# EasyEDA schematic SCH_PS2_Floppy_MediaSense_Adapter_2024-03-08.json
TITLE: PS/2 Floppy Media Sense; REV: 0.91a; Date: 2024-02-25; Sheet: 1/1; Company: Vincent Besson
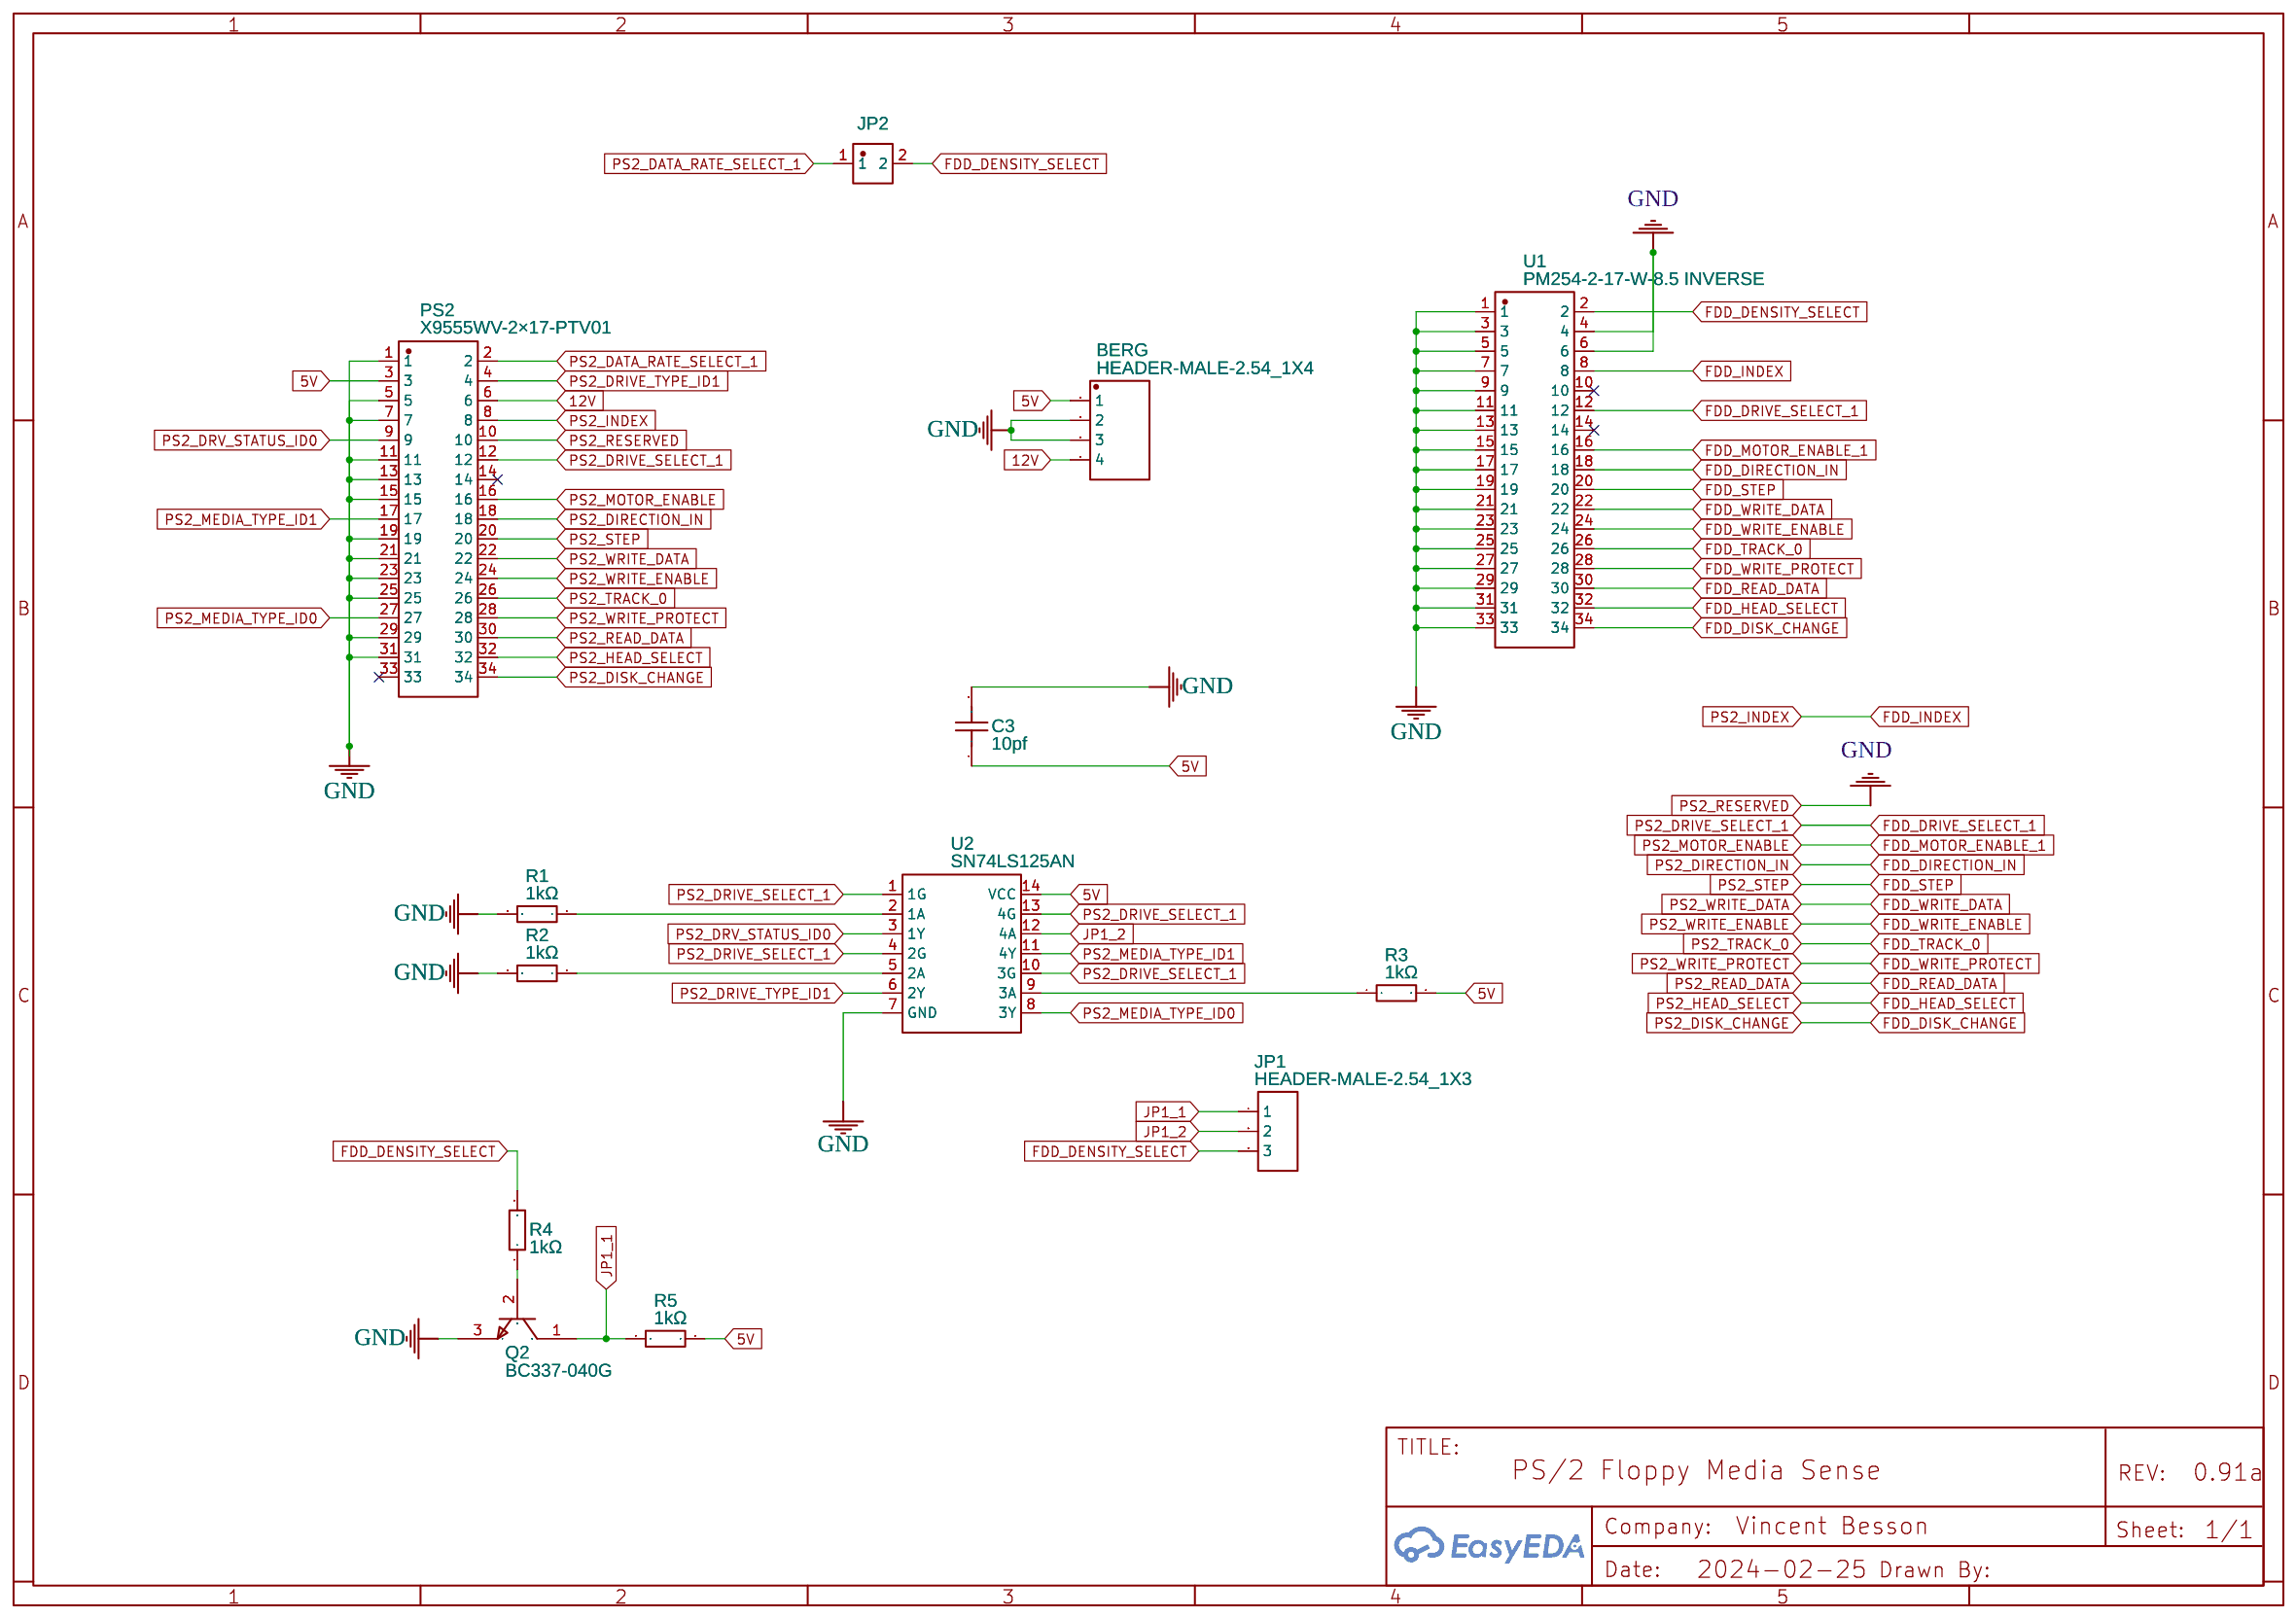
[diagram p0: schematic sheet]

## Parts
BERG  HEADER-MALE-2.54_1X4  [PIN1X4]
C3  10pf  [CAP-TH_L5.0-W5.0-P2.54-D1.0]
JP1  HEADER-MALE-2.54_1X3  [PIN1X3]
JP2  GAZPAR  [HDR-TH_2P-P2.54-V-M]
PS2  X9555WV-2×17-PTV01  [CONN-TH_X9555WV-2-17-PTV01]
Q2  BC337-040G  [TO92-INLINE]
R1  1kΩ  [RES-TH_BD2.5-L6.5-P10.50-D0.6]
R2  1kΩ  [RES-TH_BD2.5-L6.5-P10.50-D0.6]
R3  1kΩ  [RES-TH_BD2.5-L6.5-P10.50-D0.6]
R4  1kΩ  [RES-TH_BD2.5-L6.5-P10.50-D0.6]
R5  1kΩ  [RES-TH_BD2.5-L6.5-P10.50-D0.6]
U1  PM254-2-17-W-8.5 INVERSE  [HDR-TH_34P-P2.54-H-F-R2-C17-W8.5 INVERSE]
U2  SN74LS125AN  [DIP14]

## Library data of the parts
BERG = HEADER-MALE-2.54_1X4: Supplier: LCSC; Manufacturer: Ckmtw; Manufacturer Part: 210S-1*4P L=11.6MMGold-plated black; Contributor: LCSC; Supplier Part: C124378
C3 = CC1H200KA1PDCH4B3003: Contributor: LCSC; Supplier: LCSC; Supplier Part: C353911; Manufacturer: Dersonic(德尔创); JLCPCB Part Class: Extended Part; link: https://lcsc.com/eda_search?q=C353911&%26type=1&ref=editor
JP1 = HEADER-MALE-2.54_1X3: Supplier: LCSC; Manufacturer: BOOMELE; Manufacturer Part: Header2.54mm 1*3P; image: //image.lceda.cn/szlcsc/C49257.jpg; Supplier Part: C49257
JP2 = X6521WV-2X01H-C30D60: Supplier: LCSC; Supplier Part: C2883961; Manufacturer: XKB Connectivity(中国星坤); Manufacturer Part: X6521WV-2x01H-C30D60; link: https://atta.szlcsc.com/upload/public/pdf/source/20211009/DE33EBA4104B5B447A7BD8383FBBA145.pdf; Contributor: LCSC; JLCPCB Part Class: Extended Part
PS2 = X9555WV-2×17-PTV01: Contributor: LCSC; Supplier: LCSC; Supplier Part: C707014; Manufacturer: XKB Connectivity(中国星坤); Manufacturer Part: X9555WV-2x17-PTV01; link: https://lcsc.com/eda_search?q=C707014&%26type=1&ref=editor
Q2 = BC337-040G: Amplifier Transistor, NPN Silicon, 3-Pin TO-92, Pb-Free, Bulk Box
R1-R5 = MFR0W4F1002A50: Supplier: LCSC; Manufacturer: UNI-ROYAL(厚声); Supplier Part: C57436; JLCPCB Part Class: Extended Part; link: https://lcsc.com/eda_search?q=C57436&%26type=1&ref=editor
U1 = PM254-2-17-W-8.5 INVERSE: Contributor: LCSC; Supplier: LCSC; Supplier Part: C2897437; Manufacturer: HCTL(华灿天禄); Manufacturer Part: PM254-2-17-W-8.5; JLCPCB Part Class: Extended Part
U2 = SN74LS125AN

## Nets
5V: BERG.1 C3.1 PS2.3 R3.2 R5.2 U2.14(VCC)
12V: BERG.4 PS2.6
GND: BERG.2 BERG.3 C3.2 PS2.1 PS2.5 PS2.7 PS2.10 PS2.11 PS2.13 PS2.15 PS2.19 PS2.21 PS2.23 PS2.25 PS2.29 PS2.31 Q2.3(E) R1.2 R2.2 U1.1 U1.3 U1.4 U1.5 U1.6 U1.7 U1.9 U1.11 U1.13 U1.15 U1.17 U1.19 U1.21 U1.23 U1.25 U1.27 U1.29 U1.31 U1.33 U2.7(GND)
FDD_DENSITY_SELECT: JP1.3 JP2.2 R4.2 U1.2
FDD_DIRECTION_IN: PS2.18 U1.18
FDD_DISK_CHANGE: PS2.34 U1.34
FDD_DRIVE_SELECT_1: PS2.12 U1.12 U2.1(1G) U2.4(2G) U2.10(3G) U2.13(4G)
FDD_HEAD_SELECT: PS2.32 U1.32
FDD_INDEX: PS2.8 U1.8
FDD_MOTOR_ENABLE_1: PS2.16 U1.16
FDD_READ_DATA: PS2.30 U1.30
FDD_STEP: PS2.20 U1.20
FDD_TRACK_0: PS2.26 U1.26
FDD_WRITE_DATA: PS2.22 U1.22
FDD_WRITE_ENABLE: PS2.24 U1.24
FDD_WRITE_PROTECT: PS2.28 U1.28
JP1_1: JP1.1 Q2.1(C) R5.1
JP1_2: JP1.2 U2.12(4A)
PS2_DATA_RATE_SELECT_1: JP2.1 PS2.2
PS2_DRIVE_TYPE_ID1: PS2.4 U2.6(2Y)
PS2_DRV_STATUS_ID0: PS2.9 U2.3(1Y)
PS2_MEDIA_TYPE_ID0: PS2.27 U2.8(3Y)
PS2_MEDIA_TYPE_ID1: PS2.17 U2.11(4Y)
Net-(Q2-2): Q2.2(B) R4.1
Net-(R1-1): R1.1 U2.2(1A)
Net-(R2-1): R2.1 U2.5(2A)
Net-(R3-1): R3.1 U2.9(3A)

Not connected (* = marked no-connect by the designer): PS2 14* 33*; U1 10* 14*
